# Altium schematic sheet Schematic.SchDoc
size A4
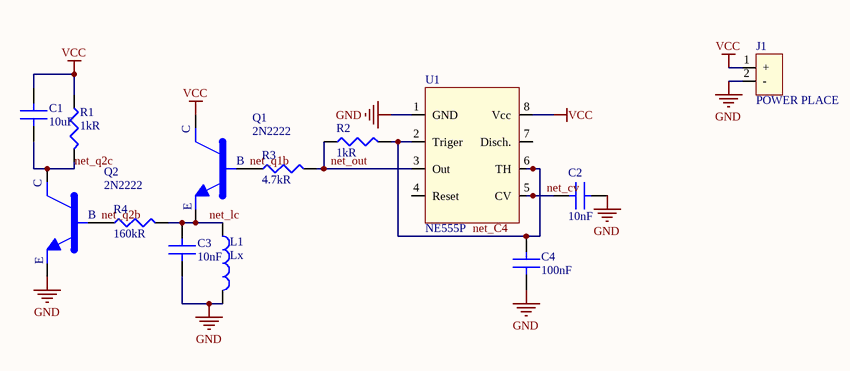
[diagram p0: Schematic.SchDoc]

## Parts
C1  10uF  [C0805]
C2  10nF  [C0805]
C3  10nF  [C0805]
C4  100nF  [C0805]
J1  POWER PLACE  [poweplc]
L1  Lx  [LX]
Q1  2N2222  [2N2222SMD]
Q2  2N2222  [2N2222SMD]
R1  1kR  [R0805]
R2  1kR  [R0805]
R3  4.7kR  [R0805]
R4  160kR  [R0805]
U1  NE555P  [NE555]

## Nets
GND: C2.2 C3.1 C4.2 J1.2(-) L1.2 Q2.2(E) U1.1(GND)
VCC: C1.2 J1.1(+) Q1.3(C) R1.2 U1.8(Vcc)
net_C4: C4.1 R2.1 U1.2(Triger) U1.6(TH)
net_cv: C2.1 U1.5(CV)
net_lc: C3.2 L1.1 Q1.2(E) R4.1
net_out: R2.2 R3.1 U1.3(Out)
net_q1b: Q1.1(B) R3.2
net_q2b: Q2.1(B) R4.2
net_q2c: C1.1 Q2.3(C) R1.1

Not connected (* = marked no-connect by the designer): U1 4(Reset) 7(Disch.)

## Library data of the parts
C1 = Cap_0805_10u: Cap Ceramic 10uF 16V X5R 10% SMD 0805 85C Cardboard T/R; Manufacturer: Samsung; Manufacturer Part Number: CL21A106KOCLRNC; Supplier 1: Future Electronics; RoHS: Yes; Category: Ceramic Capacitors; Stock 1: 131352; Pricing 1: 1=0,17600, 50=0,07680, 100=0,06630, 500=0,04710, 1500=0,03730 (USD); Mount: Surface Mount; Case/Package: 0805; Case Code (Metric): 2012; Case Code (Imperial): 0805; Min Operating Temperature: -55°C; Max Operating Temperature: 85°C; Package Quantity: 1; Packaging: Tape and Reel; Capacitance: 10uF; Tolerance: 10%; Voltage Rating: 16V; Dielectric: X5R; Series: CL; Construction: Flat; Length: 2mm; Width: 0.049inch; Height: 0.85mm; Thickness: 0.037inch; Depth: 1.25mm; Radiation Hardening: No; Lead Free: Lead Free; RoHS Compliant: Yes; ComponentLink1URL: https://datasheet.ciiva.com/25797/cl21a106koclrnc-25797024.pdf?src-supplier=Digi-Key; ComponentLink1Description: https://datasheet.ciiva.com/25797/cl21a106koclrnc-25797024.pdf?src-supplier=Digi-Key; ComponentLink2URL: https://datasheet.ciiva.com/26838/getdatasheetpartid-357378-26838585.pdf?src-supplier=Verical; ComponentLink2Description: https://datasheet.ciiva.com/26838/getdatasheetpartid-357378-26838585.pdf?src-supplier=Verical; Supplier Part Number 1: 8103687
C2 C3 = Cap_0805_10n: Cap Ceramic 0.01uF 25V X7R 10% Pad SMD 0805 125°C T/R; Manufacturer: Samsung; Manufacturer Part Number: CL21B103KAANNNC; Supplier 1: Digi-Key; RoHS: Yes; Category: Ceramic Capacitors; Stock 1: 1191; Pricing 1: 1=0,10000, 10=0,04700, 50=0,02560, 100=0,02080, 500=0,01490, 1000=0,01170 (USD); Mount: Surface Mount; Case/Package: 0805; Case Code (Metric): 2012; Case Code (Imperial): 0805; Min Operating Temperature: -55°C; Max Operating Temperature: 125°C; Package Quantity: 1; Packaging: Tape and Reel; Capacitance: 10nF; Tolerance: 10%; Voltage Rating: 25V; Dielectric: X7R; Series: CL; Construction: Flat; Length: 2mm; Width: 0.049inch; Height: 0.65mm; Thickness: 0.03inch; Depth: 1.25mm; Radiation Hardening: No; RoHS Compliant: Yes; ComponentLink1URL: https://datasheet.ciiva.com/25781/cl21b103kaannnc-25781200.pdf?src-supplier=Digi-Key; ComponentLink1Description: https://datasheet.ciiva.com/25781/cl21b103kaannnc-25781200.pdf?src-supplier=Digi-Key; ComponentLink2URL: https://datasheet.ciiva.com/16199/cl05b104kq5nnnc-16199720.pdf?src-supplier=Future+Electronics; ComponentLink2Description: https://datasheet.ciiva.com/16199/cl05b104kq5nnnc-16199720.pdf?src-supplier=Future+Electronics; Supplier Part Number 1: 1276-2434-1-ND
C4 = Cap_0805_100n: WALSIN - 0805B104K160CT - Keramikvielschichtkondensator, SMD, 0.1 µF, 16 V, 0805 [Metrisch 2012], ± 10%, X7R; Manufacturer: Walsin Technologies; Voltage Rating: 16V; Supplier 1: Digi-Key; Manufacturer Part Number: 0805B104K160CT; RoHS: Yes; Category: Ceramic Capacitors; Stock 1: 12085; Pricing 1: 1=0,12000, 10=0,08600, 50=0,04900, 100=0,04050, 500=0,02842, 1000=0,02352 (USD); Case/Package: Ceramic; Case Code (Metric): 2012; Case Code (Imperial): 0805; Min Operating Temperature: -55°C; Max Operating Temperature: 125°C; Capacitance: 100nF; Packaging: Tape and Reel; Tolerance: 10%; Dielectric: X7R; Voltage Rating (DC): 16V; Length: 2mm; Depth: 1.25mm; Radiation Hardening: No; REACH SVHC: Unknown; RoHS Compliant: Yes; ComponentLink1URL: https://datasheet.ciiva.com/26864/getdatasheetpartid-556603-26864634.pdf?src-supplier=Verical; ComponentLink1Description: https://datasheet.ciiva.com/26864/getdatasheetpartid-556603-26864634.pdf?src-supplier=Verical; Supplier Part Number 1: 1292-1565-1-ND
Q1 Q2 = SMMBT2222ALT1G: ON SEMICONDUCTOR         SMMBT2222ALT1G             Bipolar (BJT) Single Transistor, NPN, 40 V, 300 MHz, 225 mW, 600 mA, 40 hFE                          New; Max Power Dissipation: 225mW; hFE Min: 100; Frequency: 300MHz; Max Collector Current: 600mA; Collector Emitter Voltage (VCEO): 40V; Collector Base Voltage (VCBO): 75V; Emitter Base Voltage (VEBO): 6V; Collector Emitter Saturation Voltage: 1V; Number of Elements: 1; Power Dissipation: 300mW; Max Frequency: 100MHz; Supplier 1: RSComponents; Manufacturer: ON Semiconductor; Manufacturer Part Number: SMMBT2222ALT1G; RoHS: Yes; Category: BJTs; Stock 1: 6700; Pricing 1: 100=0,07100, 200=0,05900, 500=0,05200, 1000=0,04500, 2000=0,04400 (USD); Case/Package: SOT-23-3; Number of Pins: 3; Contact Plating: Tin,Matte; Min Operating Temperature: -55°C; Max Operating Temperature: 150°C; Package Quantity: 3000; Packaging: Tape and Reel; Transition Frequency: 300MHz; Collector Emitter Breakdown Voltage: 40V; Polarity: NPN; Element Configuration: Single; Max Breakdown Voltage: 40V; Gain Bandwidth Product: 300MHz; Series: -; Collector-emitter Voltage-Max: 1V; Length: 3.04mm; Width: 2.64mm; Height: 1.11mm; Radiation Hardening: No; REACH SVHC: No SVHC; Lead Free: Lead Free; RoHS Compliant: Yes; ComponentLink1URL: https://datasheet.ciiva.com/980/mmbt2222lt1-d-980645.pdf?src-supplier=Digi-Key; ComponentLink1Description: https://datasheet.ciiva.com/980/mmbt2222lt1-d-980645.pdf?src-supplier=Digi-Key; ComponentLink2URL: https://datasheet.ciiva.com/16285/mmbt2222lt1-d-80103-16285882.pdf?src-supplier=Mouser; ComponentLink2Description: https://datasheet.ciiva.com/16285/mmbt2222lt1-d-80103-16285882.pdf?src-supplier=Mouser; ComponentLink3URL: https://datasheet.ciiva.com/16488/mmbt2222lt1-d-16488314.pdf?src-supplier=Future+Electronics; ComponentLink3Description: https://datasheet.ciiva.com/16488/mmbt2222lt1-d-16488314.pdf?src-supplier=Future+Electronics; Supplier Part Number 1: 7815222
R1 R2 = Res_0805_1k: KOA SPEER ELECTRONICS         RK73H2ATTD1001F             SMD Chip Resistor, Thick Film, 1 kohm, 150 V, 0805 [2012 Metric], 125 mW,  1%, RK73H Series; Power Rating: 125mW; Voltage Rating: 150V; Temperature Coefficient: 100ppm/°C; Supplier 1: Digi-Key; Manufacturer: KOA Speer; Manufacturer Part Number: RK73H2ATTD1001F; RoHS: Yes; Category: Chip SMD Resistors; Stock 1: 32; Pricing 1: 1=0,10000, 10=0,03500, 100=0,01420, 1000=0,00640, 2500=0,00556 (USD); Case/Package: 0805; Number of Pins: 2; Case Code (Imperial): 0805; Case Code (Metric): 2012; Min Operating Temperature: -55°C; Max Operating Temperature: 155°C; Tolerance: 1%; Packaging: Tape and Reel; Package Quantity: 5000; Resistor Type: Thick Film; Termination: SMD/SMT; Voltage Rating (DC): 150V; Series: RK73H; Construction: Rectangular; Resistance Tolerance: 1%; Length: 2mm; Width: 1.25mm; Height: 0.5mm; Depth: 1.25mm; Military Standard: Not; REACH SVHC: Unknown; Lead Free: Lead Free; RoHS Compliant: Yes; ComponentLink1URL: https://datasheet.ciiva.com/5557/rk73h-5557241.pdf?src-supplier=Mouser; ComponentLink1Description: https://datasheet.ciiva.com/5557/rk73h-5557241.pdf?src-supplier=Mouser; ComponentLink2URL: https://datasheet.ciiva.com/7706/549017-7706107.pdf?src-supplier=Element14; ComponentLink2Description: https://datasheet.ciiva.com/7706/549017-7706107.pdf?src-supplier=Element14; Supplier Part Number 1: 2019-RK73H2ATTD1001FCT-ND; Resistance: 1kR
R3 = Res_0805_4.7k: Res Thick Film 0805 4.7K Ohm 1% 0.25W(1/4W) ±100ppm/C Pad SMD Automotive T/R; Manufacturer: KOA Speer; Manufacturer Part Number: RK73H2ATTD4701F; Power Rating: 125mW; Voltage Rating: 150V; Temperature Coefficient: 100ppm/°C; Supplier 1: Newark; RoHS: Yes; Category: Chip SMD Resistors; Stock 1: 68360; Pricing 1: 10=0,05500, 25=0,03500, 50=0,02500, 100=0,01900, 250=0,01400 (USD); Case/Package: 0805; Number of Pins: 2; Case Code (Imperial): 0805; Case Code (Metric): 2012; Min Operating Temperature: -55°C; Max Operating Temperature: 155°C; Tolerance: 1%; Packaging: Tape and Reel; Package Quantity: 5000; Resistor Type: Thick Film; Termination: SMD/SMT; Voltage Rating (DC): 150V; Series: RK73H; Resistance Tolerance: 1%; Length: 2mm; Width: 1.25mm; Height: 0.5mm; REACH SVHC: Unknown; Lead Free: Lead Free; RoHS Compliant: Yes; ComponentLink1URL: https://datasheet.ciiva.com/7706/549017-7706124.pdf?src-supplier=Element14; ComponentLink1Description: https://datasheet.ciiva.com/7706/549017-7706124.pdf?src-supplier=Element14; Supplier Part Number 1: 85AH1468; Resistance: 4.7kR
R4 = Res_0805_160k: Thick Film Resistors - SMD 0805 160Kohms 1% Tol; Manufacturer: Panasonic; Manufacturer Part Number: ERJ-6ENF1603V; Power Rating: 125mW; Voltage Rating: 150V; Temperature Coefficient: 100ppm/°C; Supplier 1: Digi-Key; RoHS: Yes; Category: Chip SMD Resistors; Stock 1: 3366; Pricing 1: 1=0,10000, 10=0,07500, 100=0,02880, 1000=0,01265, 2500=0,01092 (USD); Mount: Surface Mount; Case/Package: 0805; Case Code (Metric): 2012; Case Code (Imperial): 0805; Contact Plating: Tin; Min Operating Temperature: -55°C; Max Operating Temperature: 155°C; Tolerance: 1%; Packaging: Tape and Reel; Package Quantity: 1; Resistor Type: Thick Film; Number of Terminations: 2; Termination: SMD/SMT; Max Power Dissipation: 125mW; Series: ERJ; Resistance Tolerance: 1%; Construction: Rectangular; Features: Automotive AEC-Q200; Length: 2mm; Width: 0.049inch; Height: 0.028inch; Depth: 1.25mm; Radiation Hardening: No; REACH SVHC: No SVHC; Military Standard: Not; RoHS Compliant: Yes; ComponentLink1URL: https://datasheet.ciiva.com/22674/1678782-22674517.pdf?src-supplier=Element14; ComponentLink1Description: https://datasheet.ciiva.com/22674/1678782-22674517.pdf?src-supplier=Element14; ComponentLink2URL: https://datasheet.ciiva.com/46436/1678782-46436470.pdf?src-supplier=Element14; ComponentLink2Description: https://datasheet.ciiva.com/46436/1678782-46436470.pdf?src-supplier=Element14; ComponentLink3URL: https://datasheet.ciiva.com/9185/aoa0000ce2-9185402.pdf?src-supplier=Avnet; ComponentLink3Description: https://datasheet.ciiva.com/9185/aoa0000ce2-9185402.pdf?src-supplier=Avnet; ComponentLink4URL: https://datasheet.ciiva.com/22739/1678782-22739739.pdf?src-supplier=Element14; ComponentLink4Description: https://datasheet.ciiva.com/22739/1678782-22739739.pdf?src-supplier=Element14; ComponentLink5URL: https://datasheet.ciiva.com/24060/aoa0000ce2-24060654.pdf?src-supplier=Mouser; ComponentLink5Description: https://datasheet.ciiva.com/24060/aoa0000ce2-24060654.pdf?src-supplier=Mouser; ComponentLink6URL: https://datasheet.ciiva.com/46436/1678782-46436469.pdf?src-supplier=Element14; ComponentLink6Description: https://datasheet.ciiva.com/46436/1678782-46436469.pdf?src-supplier=Element14; ComponentLink7URL: https://datasheet.ciiva.com/17207/aoa0000ce2-17207337.pdf?src-supplier=Avnet+Europe; ComponentLink7Description: https://datasheet.ciiva.com/17207/aoa0000ce2-17207337.pdf?src-supplier=Avnet+Europe; Supplier Part Number 1: P160KCCT-ND; Resistance: 160kR
U1 = NE555P: Standard Timer Single 8-Pin PDIP Tube; Manufacturer: Texas Instruments; Frequency: 500kHz; Min Supply Voltage: 4.5V; Max Supply Voltage: 16V; Operating Supply Voltage: 5V; Current Rating: 10mA; Nominal Supply Current: 2mA; Number of Timers/Counters: 1; Quiescent Current: 15mA; High Level Output Current: -200mA; Low Level Output Current: 200mA; Supplier 1: Digi-Key; Manufacturer Part Number: NE555P; RoHS: Yes; Category: Clock and Timing; Stock 1: 3671; Pricing 1: 1=0,37000, 10=0,29900, 25=0,27360, 100=0,20350, 250=0,18444, 500=0,15264, 1000=0,11448, 2500=0,10494, 5000=0,10020 (USD); Mount: Through Hole; Case/Package: PDIP; Number of Pins: 8; Weight: 0.015535oz; Contact Plating: Gold; Min Operating Temperature: 0°C; Max Operating Temperature: 70°C; Packaging: Rail/Tube; Package Quantity: 50; Operating Supply Current: 10mA; Length: 9.81mm; Width: 6.35mm; Height: 4.57mm; Radiation Hardening: No; REACH SVHC: No SVHC; Lead Free: Lead Free; RoHS Compliant: Yes; ComponentLink1URL: https://datasheet.ciiva.com/1139/sa555-1139904.pdf?src-supplier=Element14; ComponentLink1Description: https://datasheet.ciiva.com/1139/sa555-1139904.pdf?src-supplier=Element14; ComponentLink2URL: https://datasheet.ciiva.com/19457/904085-19457361.pdf?src-supplier=Jameco; ComponentLink2Description: https://datasheet.ciiva.com/19457/904085-19457361.pdf?src-supplier=Jameco; ComponentLink3URL: https://datasheet.ciiva.com/26325/152184-da-01-en-ne555p-timer-tid-26325915.pdf?src-supplier=Conrad; ComponentLink3Description: https://datasheet.ciiva.com/26325/152184-da-01-en-ne555p-timer-tid-26325915.pdf?src-supplier=Conrad; ComponentLink4URL: https://datasheet.ciiva.com/1147/1764032-1147750.pdf?src-supplier=Newark; ComponentLink4Description: https://datasheet.ciiva.com/1147/1764032-1147750.pdf?src-supplier=Newark; ComponentLink5URL: https://datasheet.ciiva.com/14094/ne555-series-eng-tds-14094950.pdf?src-supplier=Distrelec; ComponentLink5Description: https://datasheet.ciiva.com/14094/ne555-series-eng-tds-14094950.pdf?src-supplier=Distrelec; ComponentLink6URL: https://datasheet.ciiva.com/14274/ne555-14274456.pdf?src-supplier=Avnet; ComponentLink6Description: https://datasheet.ciiva.com/14274/ne555-14274456.pdf?src-supplier=Avnet; ComponentLink7URL: https://datasheet.ciiva.com/15152/getdatasheetpartid-248510-15152620.pdf?src-supplier=Verical; ComponentLink7Description: https://datasheet.ciiva.com/15152/getdatasheetpartid-248510-15152620.pdf?src-supplier=Verical; ComponentLink8URL: https://datasheet.ciiva.com/1233/ne555-1233454.pdf?src-supplier=Digi-Key; ComponentLink8Description: https://datasheet.ciiva.com/1233/ne555-1233454.pdf?src-supplier=Digi-Key; ComponentLink9URL: https://datasheet.ciiva.com/26228/ne555-26228892.pdf?src-supplier=Avnet+Europe; ComponentLink9Description: https://datasheet.ciiva.com/26228/ne555-26228892.pdf?src-supplier=Avnet+Europe; Supplier Part Number 1: 296-NE555P-ND